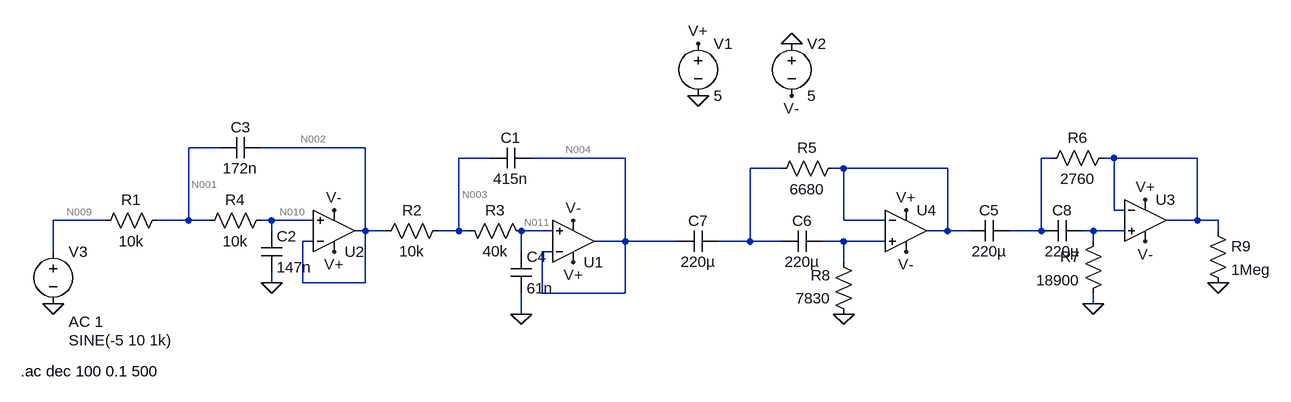
[diagram p0: schematic Draft3.asc]
Draft3.asc, the LTspice schematic file:
Version 4
SHEET 1 1160 680
WIRE -512 -16 -560 -16
WIRE -288 -16 -448 -16
WIRE -96 0 -144 0
WIRE 112 0 -32 0
WIRE 768 0 752 0
WIRE 864 0 848 0
WIRE 992 0 864 0
WIRE 352 16 304 16
WIRE 448 16 432 16
WIRE 608 16 448 16
WIRE 864 80 864 0
WIRE 880 80 864 80
WIRE -688 96 -768 96
WIRE -560 96 -560 -16
WIRE -560 96 -608 96
WIRE -528 96 -560 96
WIRE -432 96 -448 96
WIRE -368 96 -432 96
WIRE 448 96 448 16
WIRE 512 96 448 96
WIRE 992 96 992 0
WIRE 992 96 944 96
WIRE 1024 96 992 96
WIRE -432 112 -432 96
WIRE -288 112 -288 -16
WIRE -288 112 -304 112
WIRE -256 112 -288 112
WIRE -144 112 -144 0
WIRE -144 112 -176 112
WIRE -128 112 -144 112
WIRE 0 112 -48 112
WIRE 608 112 608 16
WIRE 608 112 576 112
WIRE 640 112 608 112
WIRE 752 112 752 0
WIRE 752 112 704 112
WIRE 832 112 816 112
WIRE 880 112 832 112
WIRE 1024 112 1024 96
WIRE -368 128 -384 128
WIRE 112 128 112 0
WIRE 112 128 64 128
WIRE 192 128 112 128
WIRE 304 128 304 16
WIRE 304 128 256 128
WIRE 352 128 304 128
WIRE 448 128 416 128
WIRE 512 128 448 128
WIRE 832 128 832 112
WIRE -768 144 -768 96
WIRE -48 144 -48 112
WIRE 0 144 -16 144
WIRE 448 160 448 128
WIRE -432 192 -432 176
WIRE -384 192 -384 128
WIRE -288 192 -288 112
WIRE -288 192 -384 192
WIRE -16 208 -16 144
WIRE 112 208 112 128
WIRE 112 208 -16 208
WIRE 832 224 832 208
WIRE -48 240 -48 208
FLAG -48 240 0
FLAG -432 192 0
FLAG 832 224 0
FLAG 448 240 0
FLAG 368 -176 0
FLAG 224 -96 0
FLAG 1024 192 0
FLAG -768 224 0
FLAG 368 -96 V-
FLAG 224 -176 V+
FLAG 32 160 V+
FLAG -336 144 V+
FLAG 544 80 V+
FLAG 912 64 V+
FLAG 912 128 V-
FLAG 544 144 V-
FLAG 32 96 V-
FLAG -336 80 V-
SYMBOL Opamps\\UniversalOpAmp 32 128 M180
SYMATTR InstName U1
SYMBOL res -592 80 R90
WINDOW 0 0 56 VBottom 2
WINDOW 3 32 56 VTop 2
SYMATTR InstName R1
SYMATTR Value 10k
SYMBOL res -160 96 R90
WINDOW 0 0 56 VBottom 2
WINDOW 3 32 56 VTop 2
SYMATTR InstName R2
SYMATTR Value 10k
SYMBOL res -144 96 M90
WINDOW 0 0 56 VBottom 2
WINDOW 3 32 56 VTop 2
SYMATTR InstName R3
SYMATTR Value 40k
SYMBOL cap -96 -16 M90
WINDOW 0 0 32 VBottom 2
WINDOW 3 32 32 VTop 2
SYMATTR InstName C1
SYMATTR Value 415n
SYMBOL cap -448 112 R0
SYMATTR InstName C2
SYMATTR Value 147n
SYMBOL res -432 80 R90
WINDOW 0 0 56 VBottom 2
WINDOW 3 32 56 VTop 2
SYMATTR InstName R4
SYMATTR Value 10k
SYMBOL cap -448 -32 R90
WINDOW 0 0 32 VBottom 2
WINDOW 3 32 32 VTop 2
SYMATTR InstName C3
SYMATTR Value 172n
SYMBOL Opamps\\UniversalOpAmp -336 112 M180
SYMATTR InstName U2
SYMBOL cap -64 144 R0
SYMATTR InstName C4
SYMATTR Value 61n
SYMBOL Opamps\\UniversalOpAmp 912 96 R0
SYMATTR InstName U3
SYMBOL res 448 0 R90
WINDOW 0 0 56 VBottom 2
WINDOW 3 32 56 VTop 2
SYMATTR InstName R5
SYMATTR Value 6680
SYMBOL res 864 -16 R90
WINDOW 0 0 56 VBottom 2
WINDOW 3 32 56 VTop 2
SYMATTR InstName R6
SYMATTR Value 2760
SYMBOL res 848 112 M0
SYMATTR InstName R7
SYMATTR Value 18900
SYMBOL cap 640 96 M90
WINDOW 0 0 32 VBottom 2
WINDOW 3 32 32 VTop 2
SYMATTR InstName C5
SYMATTR Value 220µ
SYMBOL cap 416 112 R90
WINDOW 0 0 32 VBottom 2
WINDOW 3 32 32 VTop 2
SYMATTR InstName C6
SYMATTR Value 220µ
SYMBOL res 464 256 R180
WINDOW 0 36 76 Left 2
WINDOW 3 36 40 Left 2
SYMATTR InstName R8
SYMATTR Value 7830
SYMBOL cap 256 112 R90
WINDOW 0 0 32 VBottom 2
WINDOW 3 32 32 VTop 2
SYMATTR InstName C7
SYMATTR Value 220µ
SYMBOL Opamps\\UniversalOpAmp 544 112 R0
SYMATTR InstName U4
SYMBOL cap 816 96 R90
WINDOW 0 0 32 VBottom 2
WINDOW 3 32 32 VTop 2
SYMATTR InstName C8
SYMATTR Value 220µ
SYMBOL voltage 224 -192 R0
WINDOW 123 0 0 Left 0
WINDOW 39 0 0 Left 0
SYMATTR InstName V1
SYMATTR Value 5
SYMBOL voltage 368 -192 R0
WINDOW 123 0 0 Left 0
WINDOW 39 0 0 Left 0
SYMATTR InstName V2
SYMATTR Value 5
SYMBOL res 1008 96 R0
SYMATTR InstName R9
SYMATTR Value 1Meg
SYMBOL voltage -768 128 R0
WINDOW 3 24 152 Left 2
WINDOW 123 24 124 Left 2
WINDOW 39 0 0 Left 0
SYMATTR InstName V3
SYMATTR Value SINE(-5 10 1k)
SYMATTR Value2 AC 1
TEXT -818 328 Left 2 !.ac dec 100 0.1 500

The netlist it stands for:
* Draft3.asc
XU1 N011 N004 V+ V- N004 level1 Avol=1Meg GBW=10Meg Vos=0 En=0 Enk=0 In=0 Ink=0 Rin=500Meg  ; pins In+ In- V+ V- OUT
R1 N001 N009 10k
R2 N003 N002 10k
R3 N003 N011 40k
C1 N003 N004 415n
C2 N010 0 147n
R4 N010 N001 10k
C3 N002 N001 172n
XU2 N010 N002 V+ V- N002 level1 Avol=1Meg GBW=10Meg Vos=0 En=0 Enk=0 In=0 Ink=0 Rin=500Meg  ; pins In+ In- V+ V- OUT
C4 N011 0 61n
XU3 N012 N006 V+ V- N006 level1 Avol=1Meg GBW=10Meg Vos=0 En=0 Enk=0 In=0 Ink=0 Rin=500Meg  ; pins In+ In- V+ V- OUT
R5 N008 N007 6680
R6 N006 N005 2760
R7 N012 0 18900
C5 N008 N005 220µ
C6 N013 N007 220µ
R8 0 N013 7830
C7 N007 N004 220µ
XU4 N013 N008 V+ V- N008 level1 Avol=1Meg GBW=10Meg Vos=0 En=0 Enk=0 In=0 Ink=0 Rin=500Meg  ; pins In+ In- V+ V- OUT
C8 N012 N005 220µ
V1 V+ 0 5
V2 0 V- 5
R9 N006 0 1Meg
V3 N009 0 SINE(-5 10 1k) AC 1
.ac dec 100 0.1 500
.lib UniversalOpAmp1.lib
.backanno
.end

* Results of the author's LTspice run, read from the files saved beside the schematic
* Operating Point, zero values left out:
*   V(n004) = -4.999 V
*   V(n011) = -4.999 V
*   V(v+) = 5 V
*   V(v-) = -5 V
*   V(n001) = -5 V
*   V(n009) = -5 V
*   V(n003) = -5 V
*   V(n002) = -5 V
*   V(n010) = -5 V
*   I(R4) = 10 nA
*   I(R3) = -9.999 nA
*   I(R2) = 9.999 nA
*   I(R1) = 10 nA
*   I(V3) = 10 nA
*   I(V2) = -20 nA
*   I(V1) = -60 nA
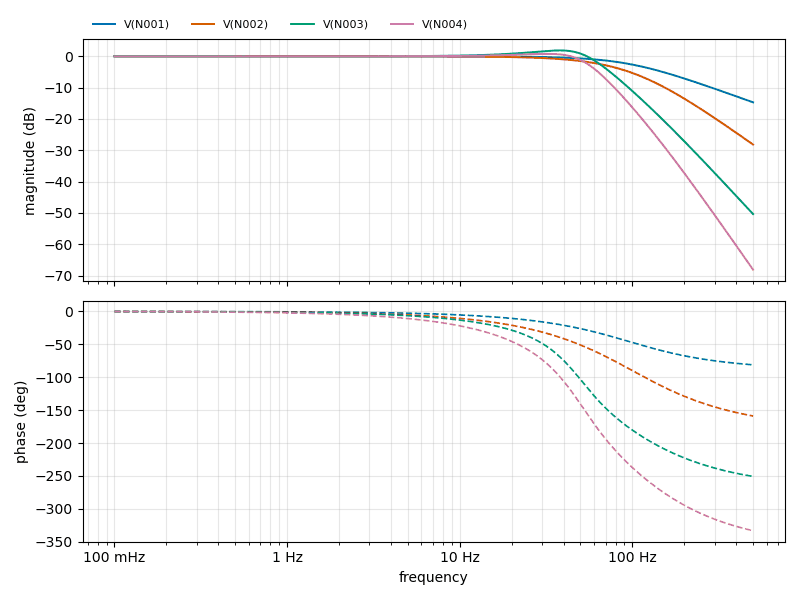
[diagram p1: AC Analysis of Draft3.asc, plotted from the saved traces]
* AC Analysis, 1 run:
*   V(N001): -0.00 dB at 100 mHz, -14.70 dB at 500 Hz, peak -0.00 dB at 100 mHz, 3 dB below the peak at 107.6 Hz
*   V(N002): -0.00 dB at 100 mHz, -28.19 dB at 500 Hz, peak -0.00 dB at 100 mHz, 3 dB below the peak at 71.94 Hz
*   V(N003): -0.00 dB at 100 mHz, -50.37 dB at 500 Hz, peak 1.88 dB at 38.02 Hz, 3 dB below the peak at 59.36 Hz
*   V(N004): -0.00 dB at 100 mHz, -68.14 dB at 500 Hz, peak 0.77 dB at 32.36 Hz, 3 dB below the peak at 54.28 Hz